# EAGLE design stm32f4breakout (EAGLE 8.3.1)

## Sheet 1 of 3
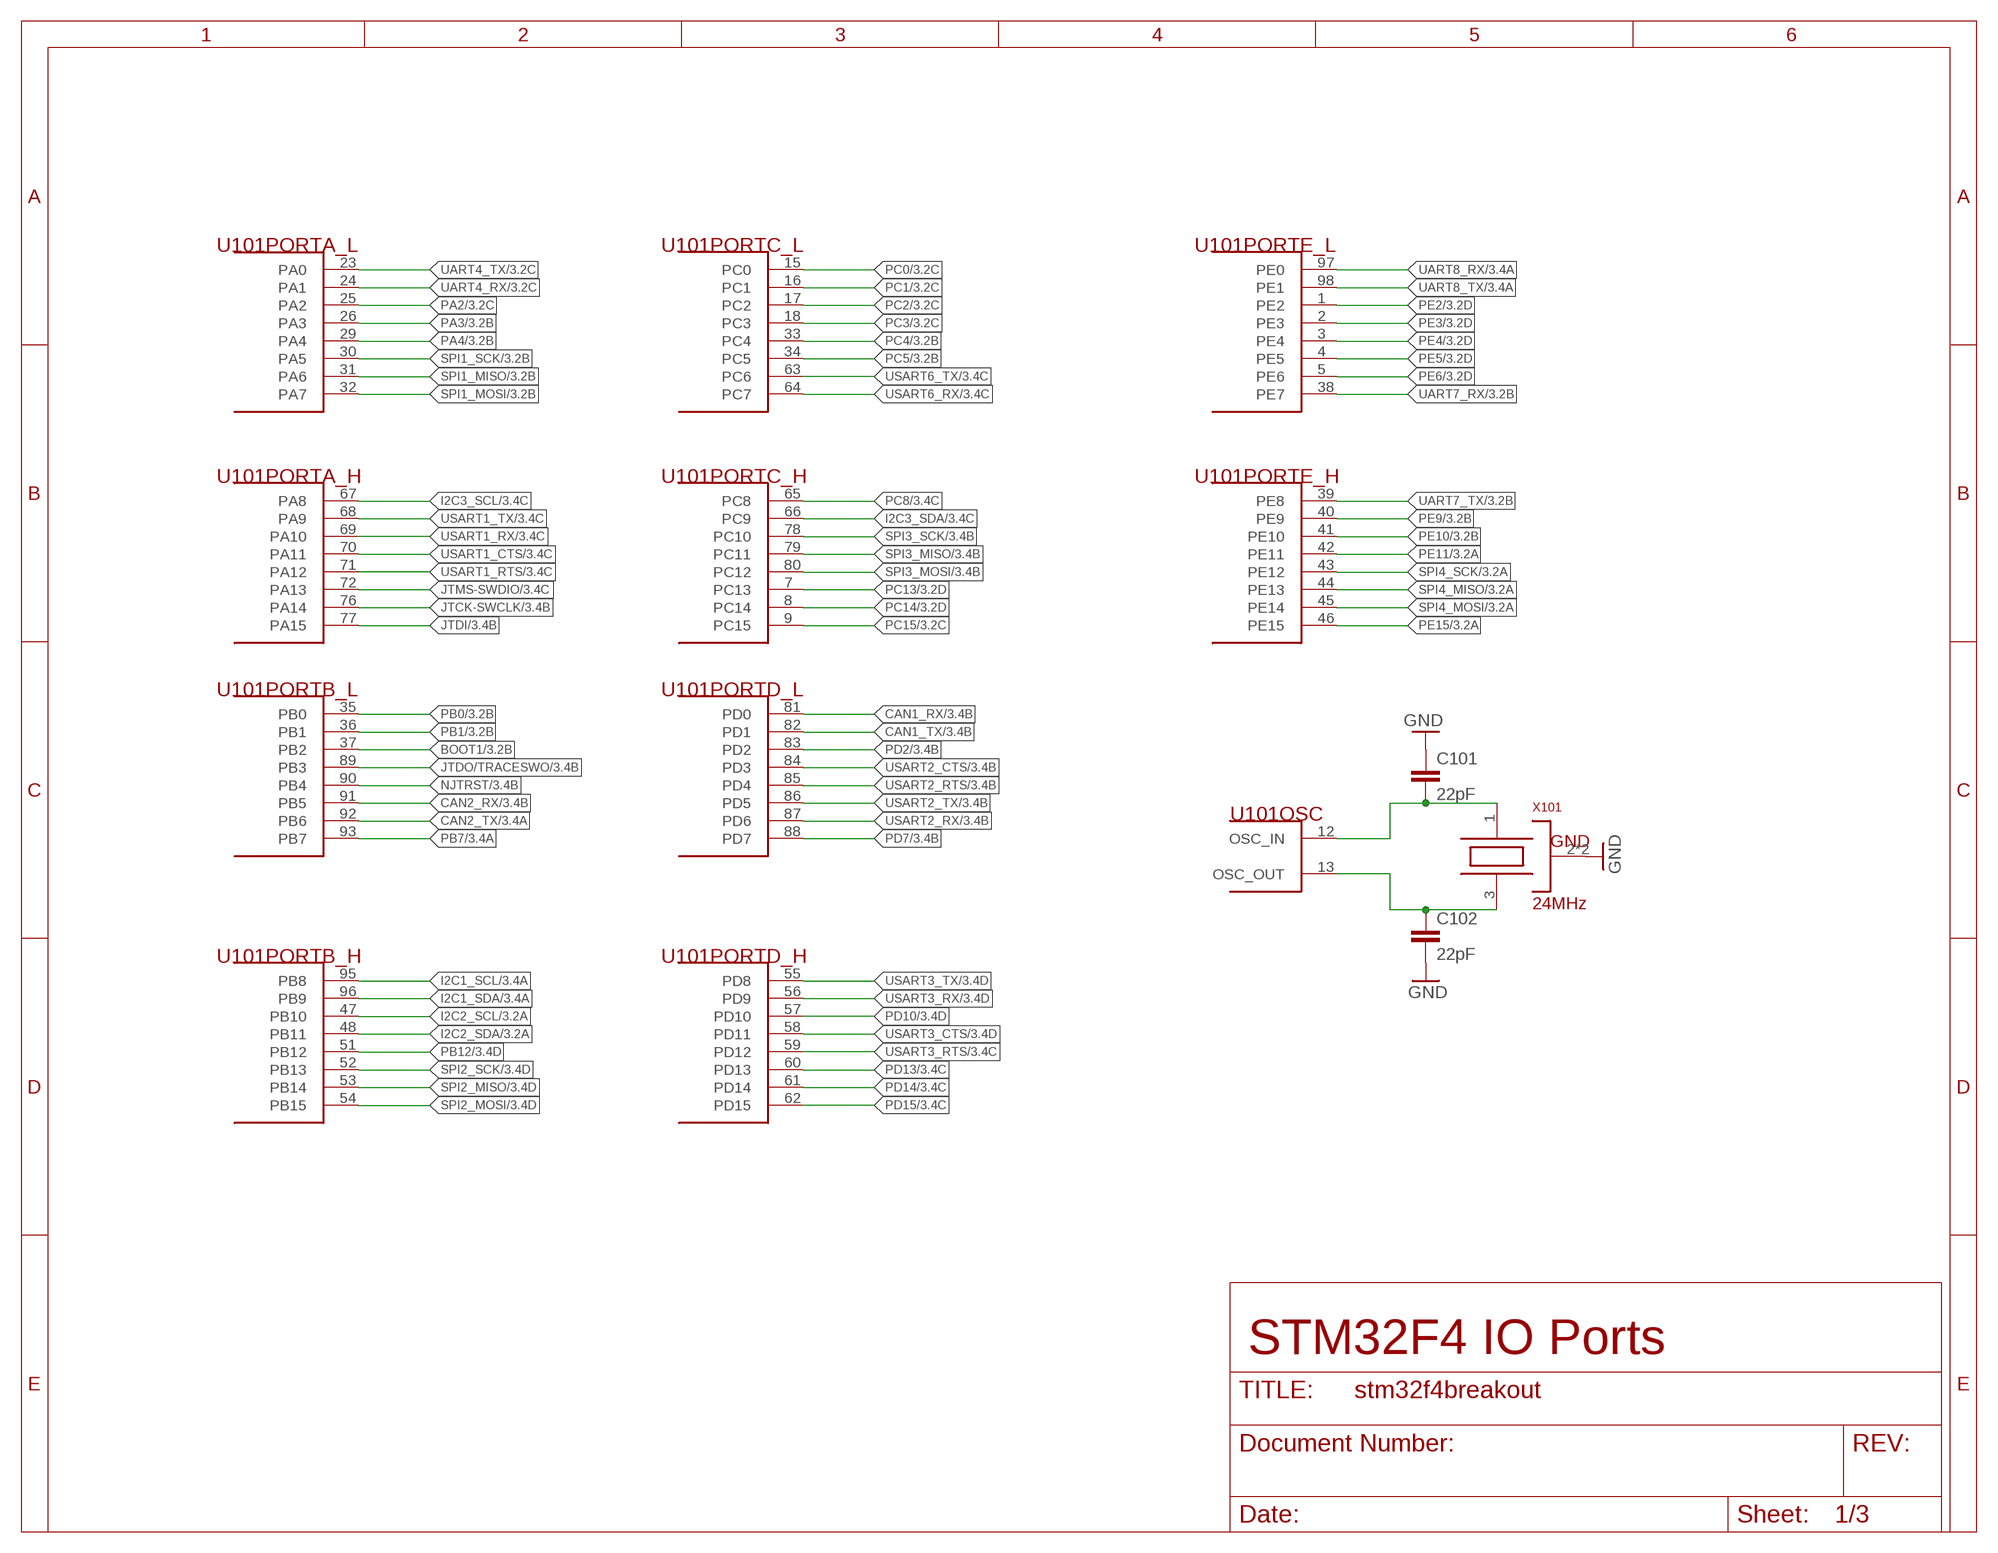
[diagram p0: schematic, sheet 1]

### Parts
C101  22pF  C-EUC0603  [C0603]
C102  22pF  C-EUC0603  [C0603]
U101  STM32F427VGT6  [LQFP-100]
X101  24MHz  OSCILLATOR  [OSC3.2X2.5]

### Nets
BOOT1: U101.37(PORTB_L:PB2) ; also sheet 3
CAN1_RX: U101.81(PORTD_L:PD0) ; also sheet 3
CAN1_TX: U101.82(PORTD_L:PD1) ; also sheet 3
CAN2_RX: U101.91(PORTB_L:PB5) ; also sheet 3
CAN2_TX: U101.92(PORTB_L:PB6) ; also sheet 3
GND: C101.1 C102.2 X101.2(GND) X101.4(GND) ; also sheet 2,3
I2C1_SCL: U101.95(PORTB_H:PB8) ; also sheet 3
I2C1_SDA: U101.96(PORTB_H:PB9) ; also sheet 3
I2C2_SCL: U101.47(PORTB_H:PB10) ; also sheet 3
I2C2_SDA: U101.48(PORTB_H:PB11) ; also sheet 3
I2C3_SCL: U101.67(PORTA_H:PA8) ; also sheet 3
I2C3_SDA: U101.66(PORTC_H:PC9) ; also sheet 3
JTCK-SWCLK: U101.76(PORTA_H:PA14) ; also sheet 3
JTDI: U101.77(PORTA_H:PA15) ; also sheet 3
JTDO/TRACESWO: U101.89(PORTB_L:PB3) ; also sheet 3
JTMS-SWDIO: U101.72(PORTA_H:PA13) ; also sheet 3
NJTRST: U101.90(PORTB_L:PB4) ; also sheet 3
OSC_IN: C101.2 U101.12(OSC:OSC_IN) X101.1(OSC1)
OSC_OUT: C102.1 U101.13(OSC:OSC_OUT) X101.3(OSC2)
PA2: U101.25(PORTA_L:PA2) ; also sheet 3
PA3: U101.26(PORTA_L:PA3) ; also sheet 3
PA4: U101.29(PORTA_L:PA4) ; also sheet 3
PB0: U101.35(PORTB_L:PB0) ; also sheet 3
PB1: U101.36(PORTB_L:PB1) ; also sheet 3
PB7: U101.93(PORTB_L:PB7) ; also sheet 3
PB12: U101.51(PORTB_H:PB12) ; also sheet 3
PC0: U101.15(PORTC_L:PC0) ; also sheet 3
PC1: U101.16(PORTC_L:PC1) ; also sheet 3
PC2: U101.17(PORTC_L:PC2) ; also sheet 3
PC3: U101.18(PORTC_L:PC3) ; also sheet 3
PC4: U101.33(PORTC_L:PC4) ; also sheet 3
PC5: U101.34(PORTC_L:PC5) ; also sheet 3
PC8: U101.65(PORTC_H:PC8) ; also sheet 3
PC13: U101.7(PORTC_H:PC13) ; also sheet 3
PC14: U101.8(PORTC_H:PC14) ; also sheet 3
PC15: U101.9(PORTC_H:PC15) ; also sheet 3
PD2: U101.83(PORTD_L:PD2) ; also sheet 3
PD7: U101.88(PORTD_L:PD7) ; also sheet 3
PD10: U101.57(PORTD_H:PD10) ; also sheet 3
PD13: U101.60(PORTD_H:PD13) ; also sheet 3
PD14: U101.61(PORTD_H:PD14) ; also sheet 3
PD15: U101.62(PORTD_H:PD15) ; also sheet 3
PE2: U101.1(PORTE_L:PE2) ; also sheet 3
PE3: U101.2(PORTE_L:PE3) ; also sheet 3
PE4: U101.3(PORTE_L:PE4) ; also sheet 3
PE5: U101.4(PORTE_L:PE5) ; also sheet 3
PE6: U101.5(PORTE_L:PE6) ; also sheet 3
PE9: U101.40(PORTE_H:PE9) ; also sheet 3
PE10: U101.41(PORTE_H:PE10) ; also sheet 3
PE11: U101.42(PORTE_H:PE11) ; also sheet 3
PE15: U101.46(PORTE_H:PE15) ; also sheet 3
SPI1_MISO: U101.31(PORTA_L:PA6) ; also sheet 3
SPI1_MOSI: U101.32(PORTA_L:PA7) ; also sheet 3
SPI1_SCK: U101.30(PORTA_L:PA5) ; also sheet 3
SPI2_MISO: U101.53(PORTB_H:PB14) ; also sheet 3
SPI2_MOSI: U101.54(PORTB_H:PB15) ; also sheet 3
SPI2_SCK: U101.52(PORTB_H:PB13) ; also sheet 3
SPI3_MISO: U101.79(PORTC_H:PC11) ; also sheet 3
SPI3_MOSI: U101.80(PORTC_H:PC12) ; also sheet 3
SPI3_SCK: U101.78(PORTC_H:PC10) ; also sheet 3
SPI4_MISO: U101.44(PORTE_H:PE13) ; also sheet 3
SPI4_MOSI: U101.45(PORTE_H:PE14) ; also sheet 3
SPI4_SCK: U101.43(PORTE_H:PE12) ; also sheet 3
UART4_RX: U101.24(PORTA_L:PA1) ; also sheet 3
UART4_TX: U101.23(PORTA_L:PA0) ; also sheet 3
UART7_RX: U101.38(PORTE_L:PE7) ; also sheet 3
UART7_TX: U101.39(PORTE_H:PE8) ; also sheet 3
UART8_RX: U101.97(PORTE_L:PE0) ; also sheet 3
UART8_TX: U101.98(PORTE_L:PE1) ; also sheet 3
USART1_CTS: U101.70(PORTA_H:PA11) ; also sheet 3
USART1_RTS: U101.71(PORTA_H:PA12) ; also sheet 3
USART1_RX: U101.69(PORTA_H:PA10) ; also sheet 3
USART1_TX: U101.68(PORTA_H:PA9) ; also sheet 3
USART2_CTS: U101.84(PORTD_L:PD3) ; also sheet 3
USART2_RTS: U101.85(PORTD_L:PD4) ; also sheet 3
USART2_RX: U101.87(PORTD_L:PD6) ; also sheet 3
USART2_TX: U101.86(PORTD_L:PD5) ; also sheet 3
USART3_CTS: U101.58(PORTD_H:PD11) ; also sheet 3
USART3_RTS: U101.59(PORTD_H:PD12) ; also sheet 3
USART3_RX: U101.56(PORTD_H:PD9) ; also sheet 3
USART3_TX: U101.55(PORTD_H:PD8) ; also sheet 3
USART6_RX: U101.64(PORTC_L:PC7) ; also sheet 3
USART6_TX: U101.63(PORTC_L:PC6) ; also sheet 3

### Notes on the sheet
- STM32F4 IO Ports

## Sheet 2 of 3
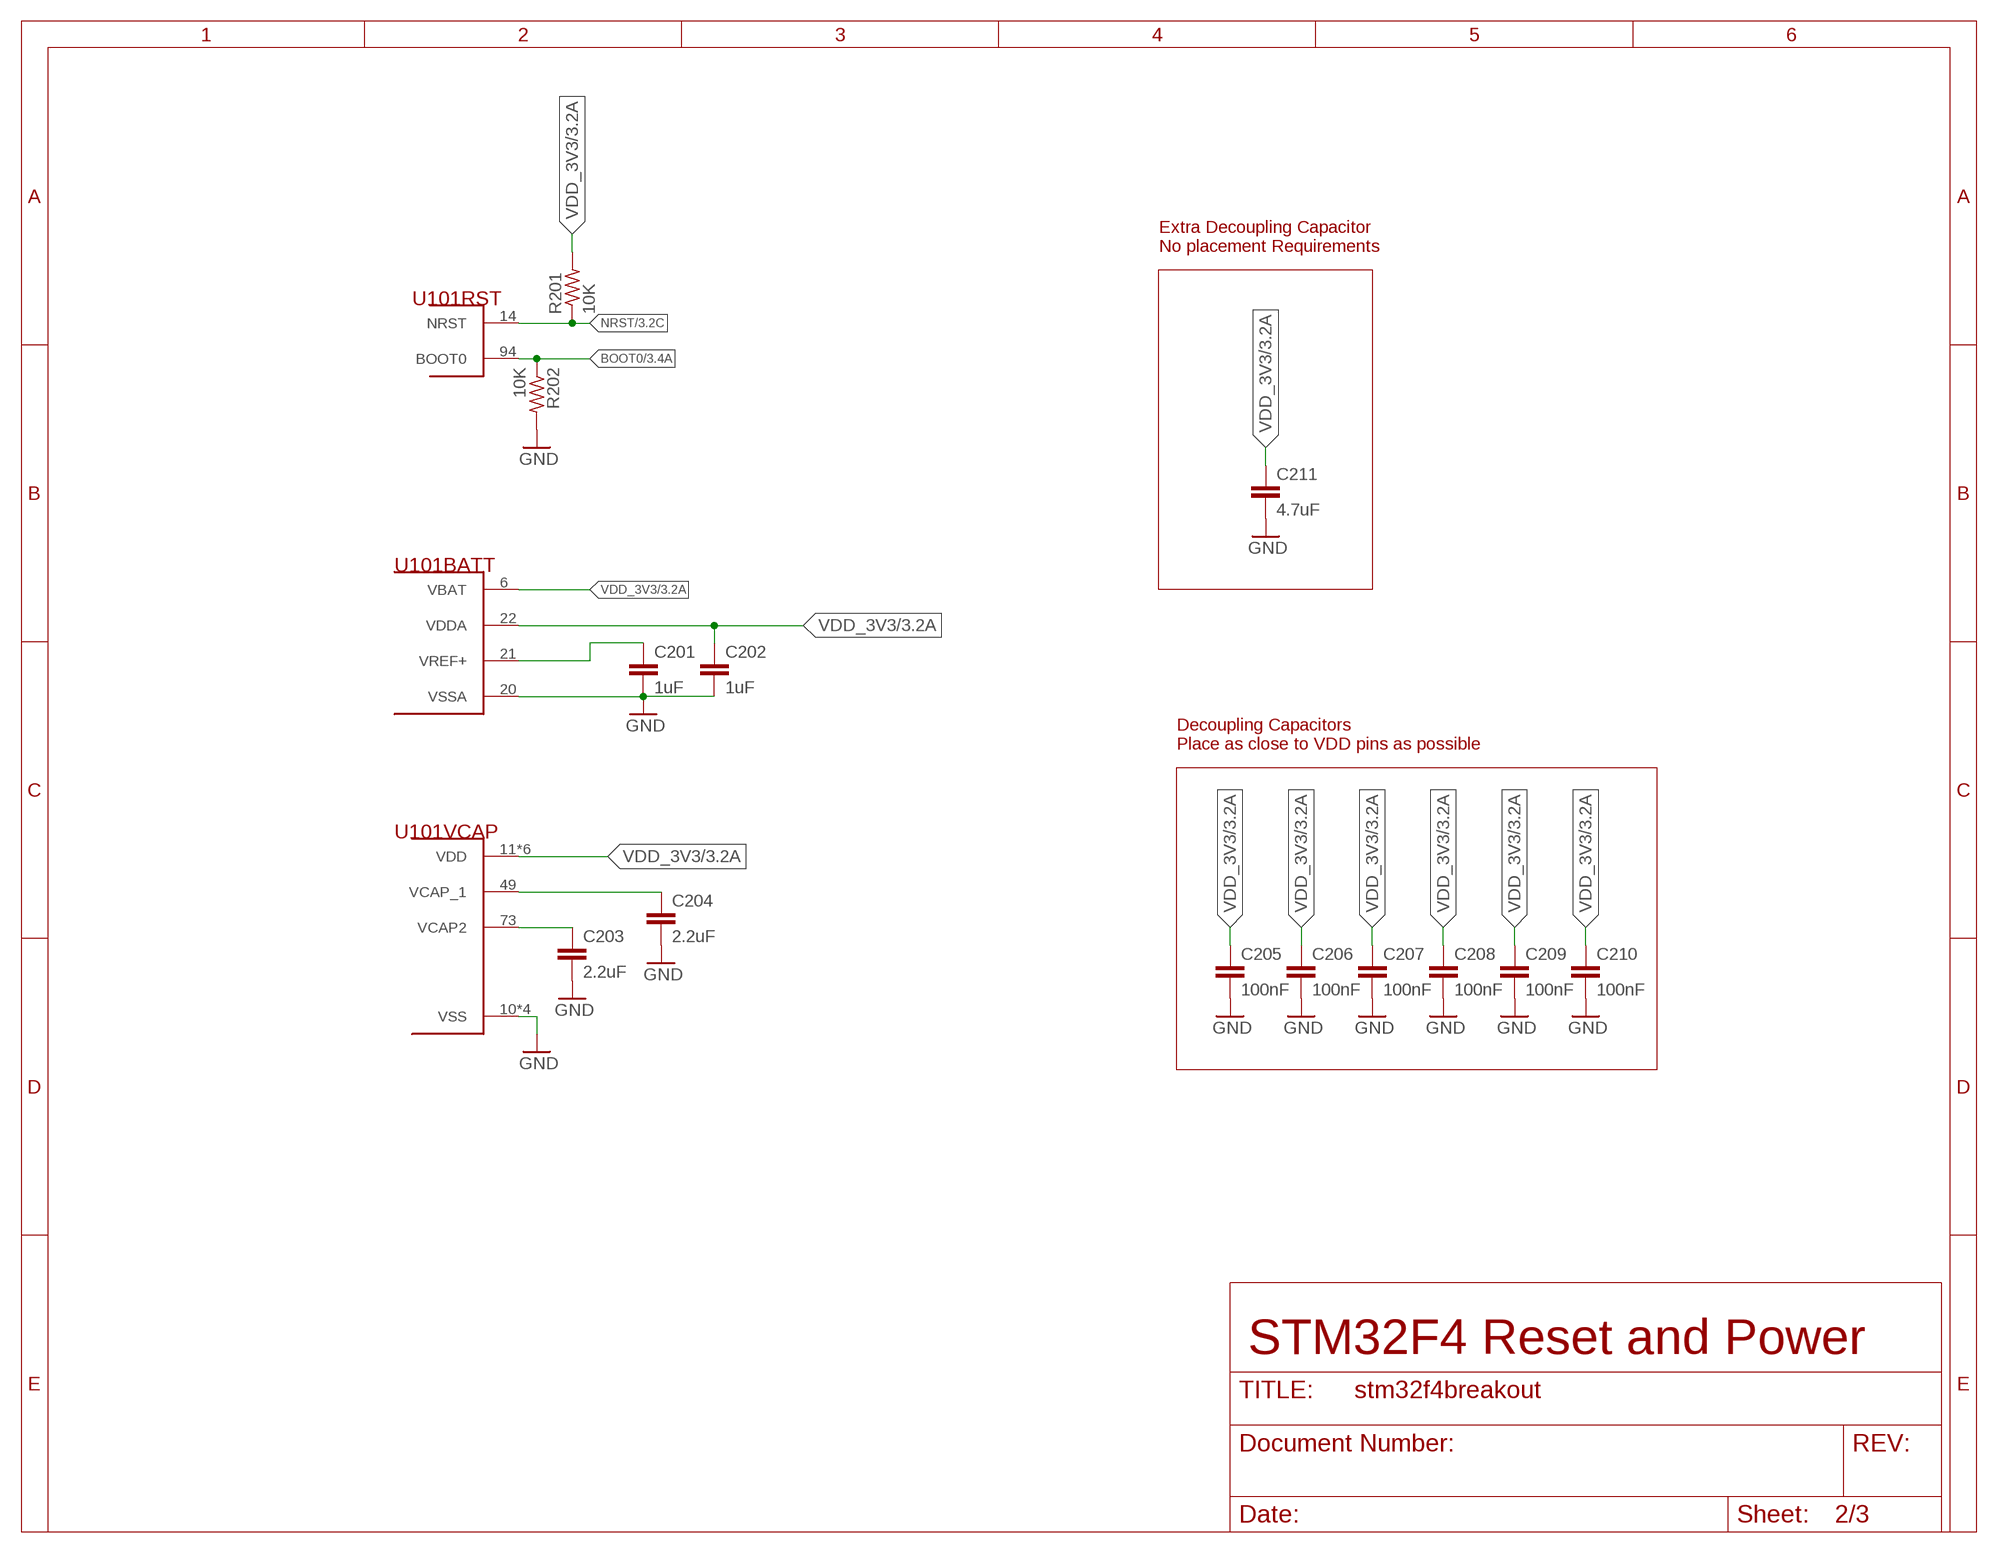
[diagram p1: schematic, sheet 2]

### Parts
C201  1uF  C-EUC0603  [C0603]
C202  1uF  C-EUC0603  [C0603]
C203  2.2uF  C-EUC0603  [C0603]
C204  2.2uF  C-EUC0603  [C0603]
C205  100nF  C-EUC0603  [C0603]
C206  100nF  C-EUC0603  [C0603]
C207  100nF  C-EUC0603  [C0603]
C208  100nF  C-EUC0603  [C0603]
C209  100nF  C-EUC0603  [C0603]
C210  100nF  C-EUC0603  [C0603]
C211  4.7uF  C-EUC0603  [C0603]
R201  10K  R-US_R0603  [R0603]
R202  10K  R-US_R0603  [R0603]

### Nets
BOOT0: R202.1 U101.94(RST:BOOT0) ; also sheet 3
GND: C201.2 C202.2 C203.2 C204.2 C205.2 C206.2 C207.2 C208.2 C209.2 C210.2 C211.2 R202.2 U101.10(VCAP:VSS) U101.20(BATT:VSSA) U101.27(VCAP:VSS) U101.74(VCAP:VSS) U101.99(VCAP:VSS) ; also sheet 1,3
NRST: R201.1 U101.14(RST:NRST) ; also sheet 3
VCAP2: C203.1 U101.73(VCAP:VCAP2)
VCAP_1: C204.1 U101.49(VCAP:VCAP_1)
VDD_3V3: C201.1 C202.1 C205.1 C206.1 C207.1 C208.1 C209.1 C210.1 C211.1 R201.2 U101.6(BATT:VBAT) U101.11(VCAP:VDD) U101.19(VCAP:VDD) U101.21(BATT:VREF+) U101.22(BATT:VDDA) U101.28(VCAP:VDD) U101.50(VCAP:VDD) U101.75(VCAP:VDD) U101.100(VCAP:VDD) ; also sheet 3

### Notes on the sheet
- Extra Decoupling Capacitor
  No placement Requirements
- Decoupling Capacitors
  Place as close to VDD pins as possible
- STM32F4 Reset and Power

## Sheet 3 of 3
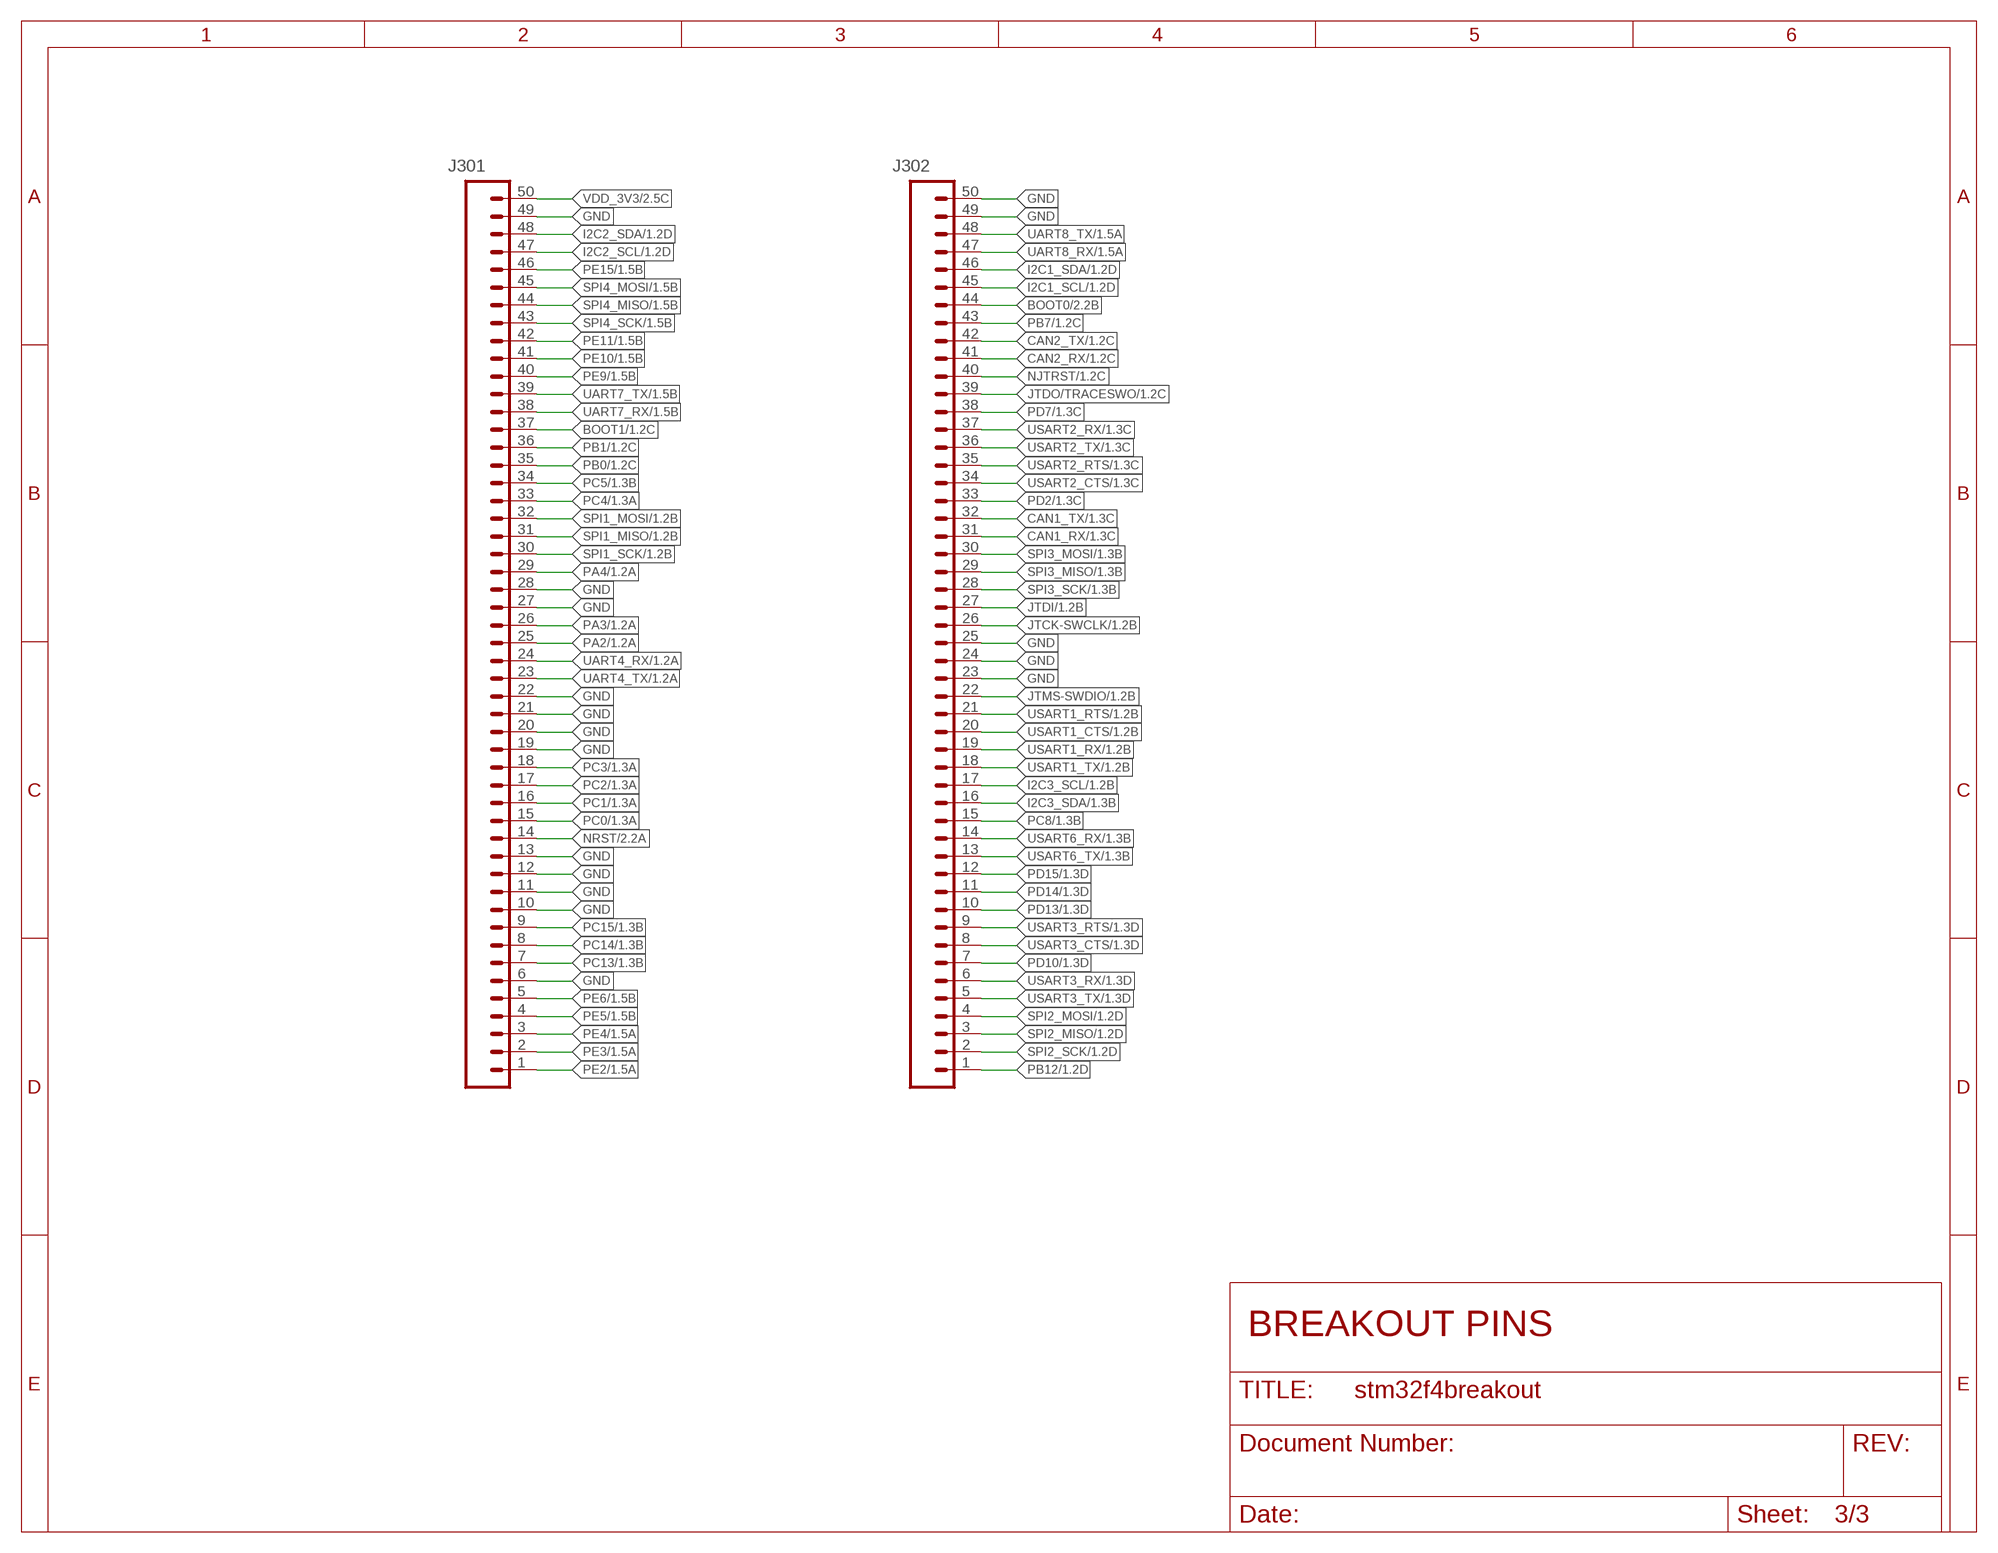
[diagram p2: schematic, sheet 3]

### Parts
J301  PINHD-1X50  [1X50]
J302  PINHD-1X50  [1X50]

### Nets
BOOT0: J302.44 ; also sheet 2
BOOT1: J301.37 ; also sheet 1
CAN1_RX: J302.31 ; also sheet 1
CAN1_TX: J302.32 ; also sheet 1
CAN2_RX: J302.41 ; also sheet 1
CAN2_TX: J302.42 ; also sheet 1
GND: J301.6 J301.10 J301.11 J301.12 J301.13 J301.19 J301.20 J301.21 J301.22 J301.27 J301.28 J301.49 J302.23 J302.24 J302.25 J302.49 J302.50 ; also sheet 1,2
I2C1_SCL: J302.45 ; also sheet 1
I2C1_SDA: J302.46 ; also sheet 1
I2C2_SCL: J301.47 ; also sheet 1
I2C2_SDA: J301.48 ; also sheet 1
I2C3_SCL: J302.17 ; also sheet 1
I2C3_SDA: J302.16 ; also sheet 1
JTCK-SWCLK: J302.26 ; also sheet 1
JTDI: J302.27 ; also sheet 1
JTDO/TRACESWO: J302.39 ; also sheet 1
JTMS-SWDIO: J302.22 ; also sheet 1
NJTRST: J302.40 ; also sheet 1
NRST: J301.14 ; also sheet 2
PA2: J301.25 ; also sheet 1
PA3: J301.26 ; also sheet 1
PA4: J301.29 ; also sheet 1
PB0: J301.35 ; also sheet 1
PB1: J301.36 ; also sheet 1
PB7: J302.43 ; also sheet 1
PB12: J302.1 ; also sheet 1
PC0: J301.15 ; also sheet 1
PC1: J301.16 ; also sheet 1
PC2: J301.17 ; also sheet 1
PC3: J301.18 ; also sheet 1
PC4: J301.33 ; also sheet 1
PC5: J301.34 ; also sheet 1
PC8: J302.15 ; also sheet 1
PC13: J301.7 ; also sheet 1
PC14: J301.8 ; also sheet 1
PC15: J301.9 ; also sheet 1
PD2: J302.33 ; also sheet 1
PD7: J302.38 ; also sheet 1
PD10: J302.7 ; also sheet 1
PD13: J302.10 ; also sheet 1
PD14: J302.11 ; also sheet 1
PD15: J302.12 ; also sheet 1
PE2: J301.1 ; also sheet 1
PE3: J301.2 ; also sheet 1
PE4: J301.3 ; also sheet 1
PE5: J301.4 ; also sheet 1
PE6: J301.5 ; also sheet 1
PE9: J301.40 ; also sheet 1
PE10: J301.41 ; also sheet 1
PE11: J301.42 ; also sheet 1
PE15: J301.46 ; also sheet 1
SPI1_MISO: J301.31 ; also sheet 1
SPI1_MOSI: J301.32 ; also sheet 1
SPI1_SCK: J301.30 ; also sheet 1
SPI2_MISO: J302.3 ; also sheet 1
SPI2_MOSI: J302.4 ; also sheet 1
SPI2_SCK: J302.2 ; also sheet 1
SPI3_MISO: J302.29 ; also sheet 1
SPI3_MOSI: J302.30 ; also sheet 1
SPI3_SCK: J302.28 ; also sheet 1
SPI4_MISO: J301.44 ; also sheet 1
SPI4_MOSI: J301.45 ; also sheet 1
SPI4_SCK: J301.43 ; also sheet 1
UART4_RX: J301.24 ; also sheet 1
UART4_TX: J301.23 ; also sheet 1
UART7_RX: J301.38 ; also sheet 1
UART7_TX: J301.39 ; also sheet 1
UART8_RX: J302.47 ; also sheet 1
UART8_TX: J302.48 ; also sheet 1
USART1_CTS: J302.20 ; also sheet 1
USART1_RTS: J302.21 ; also sheet 1
USART1_RX: J302.19 ; also sheet 1
USART1_TX: J302.18 ; also sheet 1
USART2_CTS: J302.34 ; also sheet 1
USART2_RTS: J302.35 ; also sheet 1
USART2_RX: J302.37 ; also sheet 1
USART2_TX: J302.36 ; also sheet 1
USART3_CTS: J302.8 ; also sheet 1
USART3_RTS: J302.9 ; also sheet 1
USART3_RX: J302.6 ; also sheet 1
USART3_TX: J302.5 ; also sheet 1
USART6_RX: J302.14 ; also sheet 1
USART6_TX: J302.13 ; also sheet 1
VDD_3V3: J301.50 ; also sheet 2

### Notes on the sheet
- BREAKOUT PINS

## Library data of the parts
C101 C102 C201-C211 = quad:C-EU: CAPACITOR, European symbol
J301 J302 = quad:PINHD-1X50: 1x40 .1" header
R201 R202 = quad:R-US_: RESISTOR, American symbol
U101 = quad:STM32F427VGT6
X101 = quad:OSCILLATOR

## Board
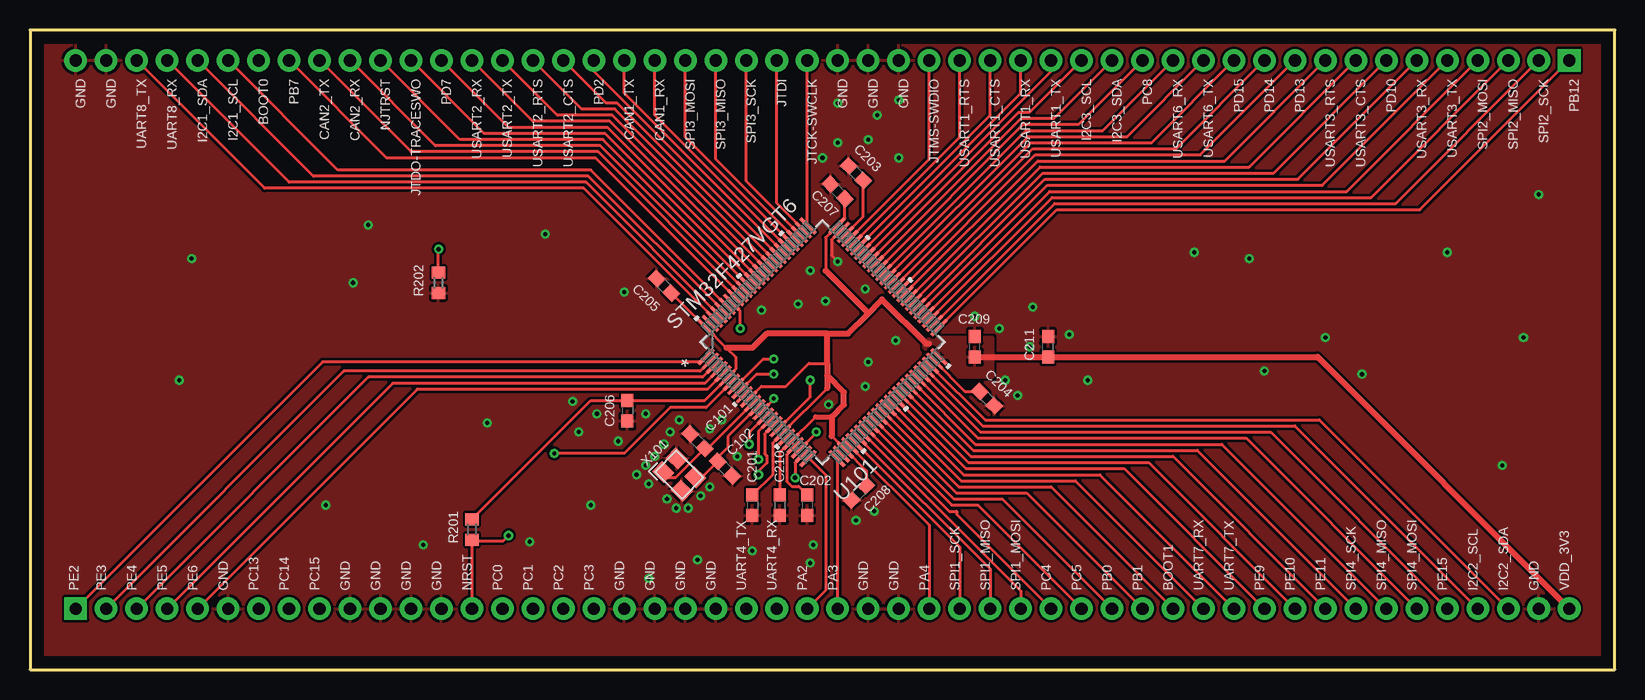
[diagram p3: board, top side]
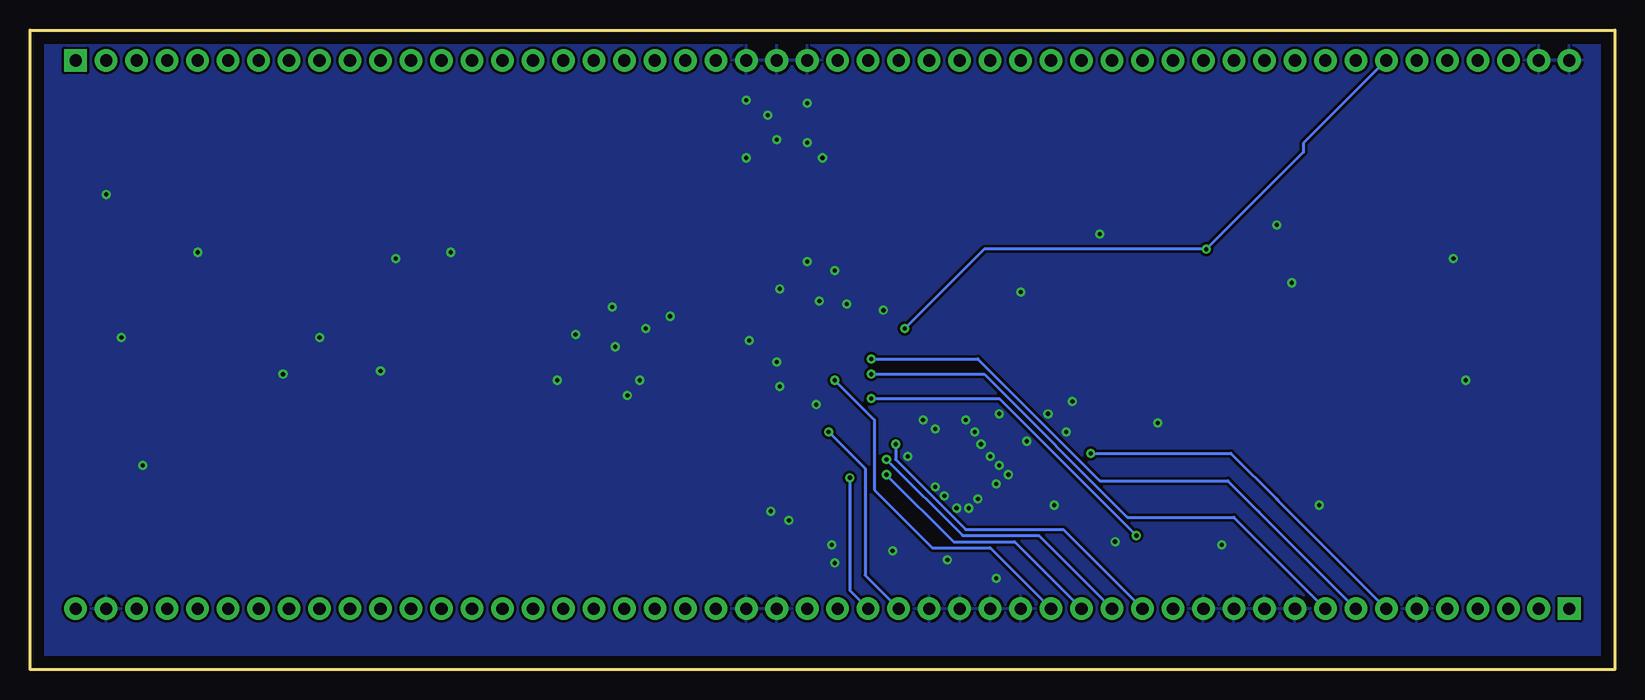
[diagram p4: board, bottom side, seen from below]

Size 132.08 x 53.34 mm. Coordinates in mm from the lower left corner, seen from the top.
Outline: 0,0 132.08,0 132.08,53.34 0,53.34 0,0
Copper layers (1*16): Top 0.035mm / dielectric 1.5mm / Bottom 0.035mm
Design rules "PCBway": minimum track width 6mil, minimum drill 0.3mm, track to track 0.205mm, track to pad 0.205mm, pad to pad 0.205mm, via to via 0.205mm, smd to smd 8mil, copper to edge 40mil, drill to drill 8mil, minimum pad ring 10mil, minimum via ring 8mil, stop-mask expansion 4mil, vias tented up to drill 25mil, thermal gap 10mil

### Footprints (pad centres in the part's own frame; a part is rotated, then mirrored left to right if it is on the bottom)
C0603 = smd 1.1 x 1: 1 -0.85,0; 2 0.85,0
1X50 = drill 1.016 pad 1.88 square: 1 -62.23,0 | drill 1.016 pad 1.88: 2 -59.69,0; 3 -57.15,0; 4 -54.61,0; 5 -52.07,0; 6 -49.53,0; 7 -46.99,0; 8 -44.45,0; 9 -41.91,0; 10 -39.37,0; 11 -36.83,0; 12 -34.29,0; 13 -31.75,0; 14 -29.21,0; 15 -26.67,0; 16 -24.13,0; 17 -21.59,0; 18 -19.05,0; 19 -16.51,0; 20 -13.97,0; 21 -11.43,0; 22 -8.89,0; 23 -6.35,0; 24 -3.81,0; 25 -1.27,0; 26 1.27,0; 27 3.81,0; 28 6.35,0; 29 8.89,0; 30 11.43,0; 31 13.97,0; 32 16.51,0; 33 19.05,0; 34 21.59,0; 35 24.13,0; 36 26.67,0; 37 29.21,0; 38 31.75,0; 39 34.29,0; 40 36.83,0; 41 39.37,0; 42 41.91,0; 43 44.45,0; 44 46.99,0; 45 49.53,0; 46 52.07,0; 47 54.61,0; 48 57.15,0; 49 59.69,0; 50 62.23,0
R0603 = smd 1 x 1.1: 1 -0.85,0; 2 0.85,0
LQFP-100 = smd 1.778 x 0.279: 1 -7.722,6; 2 -7.722,5.5; 3 -7.722,5; 4 -7.722,4.5; 5 -7.722,4; 6 -7.722,3.5; 7 -7.722,3; 8 -7.722,2.5; 9 -7.722,2; 10 -7.722,1.5; 11 -7.722,1; 12 -7.722,0.5; 13 -7.722,0; 14 -7.722,-0.5; 15 -7.722,-1; 16 -7.722,-1.5; 17 -7.722,-2; 18 -7.722,-2.5; 19 -7.722,-3; 20 -7.722,-3.5; 21 -7.722,-4; 22 -7.722,-4.5; 23 -7.722,-5; 24 -7.722,-5.5; 25 -7.722,-6; 51 7.722,-6; 52 7.722,-5.5; 53 7.722,-5; 54 7.722,-4.5; 55 7.722,-4; 56 7.722,-3.5; 57 7.722,-3; 58 7.722,-2.5; 59 7.722,-2; 60 7.722,-1.5; 61 7.722,-1; 62 7.722,-0.5; 63 7.722,0; 64 7.722,0.5; 65 7.722,1; 66 7.722,1.5; 67 7.722,2; 68 7.722,2.5; 69 7.722,3; 70 7.722,3.5; 71 7.722,4; 72 7.722,4.5; 73 7.722,5; 74 7.722,5.5; 75 7.722,6 | smd 0.279 x 1.778: 26 -6,-7.722; 27 -5.5,-7.722; 28 -5,-7.722; 29 -4.5,-7.722; 30 -4,-7.722; 31 -3.5,-7.722; 32 -3,-7.722; 33 -2.5,-7.722; 34 -2,-7.722; 35 -1.5,-7.722; 36 -1,-7.722; 37 -0.5,-7.722; 38 0,-7.722; 39 0.5,-7.722; 40 1,-7.722; 41 1.5,-7.722; 42 2,-7.722; 43 2.5,-7.722; 44 3,-7.722; 45 3.5,-7.722; 46 4,-7.722; 47 4.5,-7.722; 48 5,-7.722; 49 5.5,-7.722; 50 6,-7.722; 76 6,7.722; 77 5.5,7.722; 78 5,7.722; 79 4.5,7.722; 80 4,7.722; 81 3.5,7.722; 82 3,7.722; 83 2.5,7.722; 84 2,7.722; 85 1.5,7.722; 86 1,7.722; 87 0.5,7.722; 88 0,7.722; 89 -0.5,7.722; 90 -1,7.722; 91 -1.5,7.722; 92 -2,7.722; 93 -2.5,7.722; 94 -3,7.722; 95 -3.5,7.722; 96 -4,7.722; 97 -4.5,7.722; 98 -5,7.722; 99 -5.5,7.722; 100 -6,7.722
OSC3.2X2.5 = smd 1.4 x 1.2: 1 -1.1,-0.8; 2 1.1,-0.8; 3 1.1,0.8; 4 -1.1,0.8

### Placement (x,y rotation side)
C101  55.63,19.05 315 top
C102  57.91,16.76 315 top
C201  60.2,13.72 270 top
C202  64.77,13.72 270 top
C203  68.83,41.4 135 top
C204  79.76,22.61 315 top
C205  52.83,32 135 top
C206  49.78,21.59 270 top
C207  67.31,39.88 135 top
C208  69.09,14.73 225 top
C209  78.74,26.92 90 top
C210  62.48,13.72 270 top
C211  84.84,26.92 90 top
J301  66.04,5.08 0 top
J302  66.04,50.8 180 top
R201  36.83,11.68 90 top
R202  34.04,32.26 270 top
U101  66.04,27.3 45 top
X101  54.1,16.26 315 top

### Tracks (layer width: path | path; a pad name or v marks a point on that pad's centre or on a via)
BOOT0  (via drill 0.35)
  Top 0.254: v59.18,28.45 59.18,29.92 U101.94 | R202.1 34.04,35.04 v34.05,35.05
  Bottom 0.254: J302.44 25.96,43.89 25.96,43.14 v34.05,35.05 52.58,35.05 v59.18,28.45
BOOT1
  Top 0.254: U101.37 77.4,15.24 85.09,15.24 J301.37
CAN1_RX
  Top 0.254: U101.81 52.07,46.23 J302.31
CAN1_TX
  Top 0.254: U101.82 49.53,48.06 J302.32
CAN2_RX
  Top 0.254: U101.91 47.54,43.69 33.78,43.69 J302.41
CAN2_TX
  Top 0.254: U101.92 47.34,43.18 31.75,43.18 J302.42
GND  (via drill 0.35)
  Top 0.254: U101.74 66.8,35.84 66.8,34.54 v67.31,34.04
  other vias: 28.19,37.08 13.46,34.29 12.45,24.13 26.92,32.26 42.93,36.32 49.53,31.5 52.83,18.8 52.07,17.78 51.31,17.02 50.55,16.26 53.09,14.22 55.63,9.14 51.56,7.62 45.21,22.35 65.28,10.41 65.02,8.89 68.83,12.45 70.36,13.21 107.95,27.69 111,24.64 122.68,17.02 83.57,30.23 101.6,34.29 83.31,26.92 82.3,22.86 88.14,24.13 97.03,34.8 102.87,24.89 118.11,34.8 124.46,27.69 125.73,39.62 69.85,44.2 67.31,43.94 66.04,42.67 72.39,42.67 72.39,47.5 70.61,46.23 67.31,47.24 66.55,22.1 72.14,27.43 69.85,25.65 69.6,23.62 66.29,30.73 64.01,30.48 60.96,29.97 65.02,33.27 69.6,31.75 51.56,15.49 53.85,13.46 55.88,14.48 56.64,15.24 54.86,13.46 54.1,20.83 53.34,19.81 56.64,20.07 57.66,20.83 58.93,17.78 49.02,19.05 51.31,21.34 47.24,21.34 45.72,19.81 60.2,9.91 78.74,29.46 80.77,28.45 86.61,27.94 81.28,24.13 38.1,20.57 24.64,13.72 32.77,10.41 46.74,13.72 41.66,10.67
  pour Top (rank 6): 0,53.34 0,0 132.08,0 132.08,53.34
  pour Bottom (rank 6): 0,0 0,53.34 132.08,53.34 132.08,0
I2C1_SCL
  Top 0.254: U101.95 46.74,41.66 25.65,41.66 J302.45
I2C1_SDA
  Top 0.254: U101.96 46.54,41.15 23.62,41.15 J302.46
I2C2_SCL
  Top 0.254: U101.47 79.39,20.32 105.41,20.32 J301.47
I2C2_SDA
  Top 0.254: U101.48 79.59,20.83 107.44,20.83 J301.48
I2C3_SCL
  Top 0.254: U101.67 82.39,46.48 83.31,46.48 J302.17
I2C3_SDA
  Top 0.254: U101.66 82.59,45.97 85.34,45.97 J302.16
JTCK-SWCLK
  Top 0.254: U101.76 64.77,37.06 J302.26
JTDI
  Top 0.254: U101.77 62.23,38.89 J302.27
JTDO/TRACESWO
  Top 0.254: U101.89 47.93,44.7 37.85,44.7 J302.39
JTMS-SWDIO
  Top 0.254: U101.72 74.93,42.56 J302.22
NJTRST
  Top 0.254: U101.90 47.73,44.2 35.81,44.2 J302.40
NRST  (via drill 0.35)
  Top 0.254: 36.83,10.71 R201.1 | 36.83,10.71 J301.14 | U101.14 61.98,22.53 v61.98,22.61 | v39.88,11.18 39.41,10.71 36.83,10.71
  Bottom 0.254: v61.98,22.61 51.31,22.61 v39.88,11.18
OSC_IN
  Top 0.254: X101.1 52.76,16.33 53.09,16 53.78,16 C101.2 56.48,18.45 U101.12
OSC_OUT
  Top 0.254: U101.13 58.17,19.43 58.17,18.54 57.31,17.69 C102.1 55.99,16.04 X101.3
PA2
  Top 0.254: U101.25 64.95,17.6 66.29,16.26 66.29,6.6 J301.25
PA3
  Top 0.254: U101.26 67.26,5.13 J301.26
PA4
  Top 0.254: U101.29 74.93,12.05 J301.29
PB0
  Top 0.254: U101.35 77,14.22 81.03,14.22 J301.35
PB1
  Top 0.254: U101.36 77.2,14.73 83.06,14.73 J301.36
PB7
  Top 0.254: U101.93 47.14,42.67 29.72,42.67 J302.43
PB12
  Top 0.254: U101.51 85.57,38.35 115.82,38.35 J302.1
PC0  (via drill 0.35)
  Top 0.254: U101.15 59.94,19.8 v59.94,18.8
  Bottom 0.254: J301.15 45.97,11.68 54.1,11.68 59.94,17.53 v59.94,18.8
PC1  (via drill 0.35)
  Top 0.254: U101.16 60.71,19.85 v60.71,17.53
  Bottom 0.254: v60.71,17.53 54.36,11.18 48.01,11.18 J301.16
PC2  (via drill 0.35)
  Top 0.254: U101.17 61.21,19.65 61.21,18.02 61.42,17.82 61.42,17.23 60.71,16.52 v60.71,16.26
  Bottom 0.254: v60.71,16.26 55.12,10.67 50.04,10.67 J301.17
PC3  (via drill 0.35)
  Top 0.254: U101.18 65.02,22.75 v65.02,24.13
  Bottom 0.254: v65.02,24.13 61.72,20.83 61.72,14.99 56.9,10.16 52.07,10.16 J301.18
PC4
  Top 0.254: U101.33 76.6,13.21 77.22,13.21 77.22,12.95 J301.33
PC5
  Top 0.254: U101.34 76.8,13.72 78.99,13.72 J301.34
PC8
  Top 0.254: U101.65 82.79,45.47 87.38,45.47 J302.15
PC13  (via drill 0.35)
  Top 0.254: U101.7 56.34,21.84 53.34,21.84 49.53,18.03 v43.69,18.03
  Bottom 0.254: J301.7 28.05,14.08 28.19,14.22 32,18.03 v43.69,18.03
PC14  (via drill 0.35)
  Top 0.254: U101.8 61.11,25.91 v61.98,25.91
  Bottom 0.254: 29.67,13.16 29.72,13.21 | 29.67,13.16 J301.8 | 29.67,13.16 32.26,15.75 42.93,15.75 53.09,25.91 v61.98,25.91
PC15  (via drill 0.35)
  Top 0.254: U101.9 60.55,24.64 v61.98,24.64
  Bottom 0.254: J301.9 31.75,12.7 40.64,12.7 52.58,24.64 58.42,24.64 | v61.98,24.64 58.42,24.64 | 58.42,24.64 58.17,24.64
PD2
  Top 0.254: U101.83 46.99,49.89 J302.33
PD7
  Top 0.254: U101.88 48.13,45.21 39.88,45.21 J302.38
PD10
  Top 0.254: U101.57 84.38,41.4 103.63,41.4 J302.7
PD13
  Top 0.254: U101.60 83.78,42.93 97.54,42.93 J302.10
PD14
  Top 0.254: U101.61 83.58,43.43 95.5,43.43 J302.11
PD15
  Top 0.254: U101.62 83.38,43.94 93.47,43.94 J302.12
PE2
  Top 0.254: U101.1 55.9,25.65 24.38,25.65 J301.1
PE3
  Top 0.254: U101.2 55.85,24.89 26.16,24.89 J301.2
PE4
  Top 0.254: U101.3 56.05,24.38 28.19,24.38 J301.3
PE5
  Top 0.254: U101.4 56.25,23.88 30.23,23.88 J301.4
PE6
  Top 0.254: U101.5 56.45,23.37 32.26,23.37 J301.5
PE9
  Top 0.254: U101.40 78,16.76 91.19,16.76 J301.40
PE10
  Top 0.254: U101.41 78.19,17.27 93.22,17.27 J301.41
PE11
  Top 0.254: U101.42 78.39,17.78 95.25,17.78 J301.42
PE15
  Top 0.254: U101.46 79.19,19.81 103.38,19.81 J301.46
SPI1_MISO
  Top 0.254: U101.31 80.01,8.38 J301.31
SPI1_MOSI
  Top 0.254: U101.32 82.55,6.55 J301.32
SPI1_SCK
  Top 0.254: U101.30 77.47,10.22 J301.30
SPI2_MISO
  Top 0.254: U101.53 85.18,39.37 111.76,39.37 J302.3
SPI2_MOSI
  Top 0.254: U101.54 84.98,39.88 109.73,39.88 J302.4
SPI2_SCK
  Top 0.254: U101.52 85.38,38.86 113.79,38.86 J302.2
SPI3_MISO
  Top 0.254: U101.79 57.15,42.56 J302.29
SPI3_MOSI
  Top 0.254: U101.80 54.61,44.39 J302.30
SPI3_SCK
  Top 0.254: U101.78 59.69,40.73 J302.28
SPI4_MISO
  Top 0.254: U101.44 78.79,18.8 99.31,18.8 J301.44
SPI4_MOSI
  Top 0.254: U101.45 78.99,19.3 101.35,19.3 J301.45
SPI4_SCK
  Top 0.254: U101.43 78.59,18.29 97.28,18.29 J301.43
UART4_RX  (via drill 0.35)
  Top 0.254: U101.24 63.75,17.24 v63.75,16
  Bottom 0.254: v63.75,16 63.75,6.6 J301.24
UART4_TX  (via drill 0.35)
  Top 0.254: U101.23 65.53,19.73 v65.53,19.81
  Bottom 0.254: v65.53,19.81 62.48,16.76 62.48,7.87 J301.23
UART7_RX
  Top 0.254: U101.38 77.6,15.75 87.12,15.75 J301.38
UART7_TX
  Top 0.254: U101.39 77.8,16.26 89.15,16.26 J301.39
UART8_RX
  Top 0.254: U101.97 46.34,40.64 21.59,40.64 J302.47
UART8_TX
  Top 0.254: U101.98 46.14,40.13 19.56,40.13 J302.48
USART1_CTS
  Top 0.254: U101.70 80.01,46.23 J302.20
USART1_RTS
  Top 0.254: U101.71 77.47,44.39 J302.21
USART1_RX
  Top 0.254: U101.69 82.55,48.06 J302.19
USART1_TX
  Top 0.254: U101.68 85.09,49.89 J302.18
USART2_CTS
  Top 0.254: U101.84 48.93,47.24 48.01,47.24 J302.34
USART2_RTS
  Top 0.254: U101.85 48.73,46.74 45.97,46.74 J302.35
USART2_RX
  Top 0.254: U101.87 48.33,45.72 41.91,45.72 J302.37
USART2_TX
  Top 0.254: U101.86 48.53,46.23 43.94,46.23 J302.36
USART3_CTS
  Top 0.254: U101.58 84.18,41.91 101.6,41.91 J302.8
USART3_RTS
  Top 0.254: U101.59 83.98,42.42 99.57,42.42 J302.9
USART3_RX
  Top 0.254: U101.56 84.58,40.89 105.66,40.89 J302.6
USART3_TX
  Top 0.254: U101.55 84.78,40.39 107.7,40.39 J302.5
USART6_RX
  Top 0.254: U101.64 82.99,44.96 89.41,44.96 J302.14
USART6_TX
  Top 0.254: U101.63 83.19,44.45 91.44,44.45 J302.13
VCAP2
  Top 0.254: U101.73 69.44,37.77 C203.1
VCAP_1
  Top 0.254: C204.1 77.92,23.21 U101.49
VDD_3V3
  Top 0.254: C205.1 54.29,30.57 U101.100 58.02,26.84 58.81,26.05 58.81,25.07 58.1,24.36 U101.6 56.23,22.44 C206.1 46.74,22.44 R201.2 | C207.1 67.91,37.66 U101.75 66.29,36.04 66.29,33.27 | 75.74,26.11 U101.50 75.76,26.07 | C208.1 69.69,16.59 U101.28 66.8,19.47 | 66.42,23.45 U101.19 61.88,18.9 61.88,16.25 C201.1 | U101.21 62.48,18.09 C210.1 | U101.21 65.47,21.08 | 69.71,29.86 69.71,29.58 | C202.1 64.04,15.29 63.46,15.29 63.04,15.71 63.04,17.91 63.78,18.64 U101.22 U101.21 | U101.11 60.94,23.62 62.99,23.62 64.9,25.53 66.42,25.53
  Top 0.406: 65.47,21.08 66.8,21.08
  Top 0.508: 58.02,26.84 60.2,26.84 61.38,28.02 66.42,28.02 | 66.42,28.02 68.15,28.02 69.71,29.58 70.99,30.86 74.68,27.18 74.93,27.18 | 66.42,24.52 66.42,23.45 | 66.42,24.52 66.42,25.53 66.42,28.02 | 66.42,24.52 67.82,23.13 67.82,22.1 66.8,21.08 66.8,19.47 | 107.38,25.97 107.28,26.07 | 107.38,25.97 J301.50 | 66.29,33.27 69.71,29.86 | C209.1 C211.1 107.28,26.07 | 107.28,26.07 107.38,25.97
  pour Top (rank 2): 74.93,27.69 74.42,27.18 74.42,26.92 76.2,24.38 80.26,24.38 80.26,27.69

### Text on the board
tPlace: GND | GND | UART8_TX | UART8_RX | I2C1_SDA | I2C1_SCL | BOOT0 | PB7 | CAN2_TX | CAN2_RX | NJTRST | JTDO-TRACESWO | PD7 | USART2_RX | USART2_TX | USART2_RTS | USART2_CTS | PD2 | CAN1_TX | CAN1_RX | SPI3_MOSI | SPI3_MISO | SPI3_SCK | JTDI | JTCK-SWCLK | GND | GND | GND | JTMS-SWDIO | USART1_RTS | USART1_CTS | USART1_RX | USART1_TX | I2C3_SCL | I2C3_SDA | PC8 | USART6_RX | USART6_TX | PD15 | PD14 | PD13 | USART3_RTS | USART3_CTS | PD10 | USART3_RX | USART3_TX | SPI2_MOSI | SPI2_MISO | SPI2_SCK | PB12 | PE2 | PE3 | PE4 | PE5 | PE6 | GND | PC13 | PC14 | PC15 | GND | GND | GND | GND | NRST | PC0 | PC1 | PC2 | PC3 | GND | GND | GND | GND | UART4_TX | UART4_RX | PA2 | PA3 | GND | GND | PA4 | SPI1_SCK | SPI1_MISO | SPI1_MOSI | PC4 | PC5 | PB0 | PB1 | BOOT1 | UART7_RX | UART7_TX | PE9 | PE10 | PE11 | SPI4_SCK | SPI4_MISO | SPI4_MOSI | PE15 | I2C2_SCL | I2C2_SDA | GND | VDD_3V3